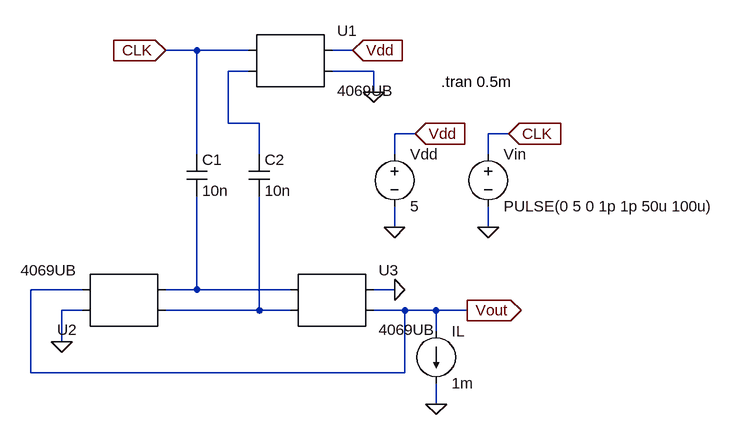
[diagram p0: schematic Q2.asc]
Q2.asc, the LTspice schematic file:
Version 4
SHEET 1 1204 752
WIRE 336 192 288 192
WIRE 416 192 336 192
WIRE 576 192 544 192
WIRE 416 224 384 224
WIRE 608 224 544 224
WIRE 608 256 608 224
WIRE 384 304 384 224
WIRE 432 304 384 304
WIRE 672 320 640 320
WIRE 816 320 784 320
WIRE 336 352 336 192
WIRE 432 352 432 304
WIRE 640 352 640 320
WIRE 784 352 784 320
WIRE 640 464 640 432
WIRE 784 464 784 432
WIRE 160 560 80 560
WIRE 336 560 336 416
WIRE 336 560 288 560
WIRE 480 560 336 560
WIRE 640 560 608 560
WIRE 160 592 128 592
WIRE 432 592 432 416
WIRE 432 592 288 592
WIRE 480 592 432 592
WIRE 656 592 608 592
WIRE 704 592 656 592
WIRE 752 592 704 592
WIRE 704 624 704 592
WIRE 128 640 128 592
WIRE 80 688 80 560
WIRE 656 688 656 592
WIRE 656 688 80 688
WIRE 704 736 704 704
FLAG 608 256 0
FLAG 640 464 0
FLAG 784 464 0
FLAG 672 320 Vdd
IOPIN 672 320 In
FLAG 816 320 CLK
IOPIN 816 320 In
FLAG 576 192 Vdd
IOPIN 576 192 In
FLAG 704 736 0
FLAG 752 592 Vout
IOPIN 752 592 Out
FLAG 640 560 0
FLAG 128 640 0
FLAG 288 192 CLK
IOPIN 288 192 In
SYMBOL voltage 784 336 R0
SYMATTR InstName Vin
SYMATTR Value PULSE(0 5 0 1p 1p 50u 100u)
SYMBOL voltage 640 336 R0
SYMATTR InstName Vdd
SYMATTR Value 5
SYMBOL AutoGenerated/4069UB 480 208 R0
SYMATTR InstName U1
SYMBOL cap 320 352 R0
SYMATTR InstName C1
SYMATTR Value 10n
SYMBOL cap 416 352 R0
SYMATTR InstName C2
SYMATTR Value 10n
SYMBOL AutoGenerated/4069UB 224 576 R180
SYMATTR InstName U2
SYMBOL AutoGenerated/4069UB 544 576 R0
SYMATTR InstName U3
SYMBOL current 704 624 R0
SYMATTR InstName IL
SYMATTR Value 1m
TEXT 712 240 Left 2 !.tran 0.5m

The netlist it stands for:
* Q2.asc
Vin CLK 0 PULSE(0 5 0 1p 1p 50u 100u)
Vdd Vdd 0 5
* U1: 4069UB (symbol AutoGenerated/4069UB not available, pins judged from their places): pin1=CLK pin2=N001 pin3=Vdd pin4=0
C1 CLK N002 10n
C2 N001 N003 10n
* U2: 4069UB (symbol AutoGenerated/4069UB not available, pins judged from their places): pin1=N003 pin2=N002 pin3=0 pin4=Vout
* U3: 4069UB (symbol AutoGenerated/4069UB not available, pins judged from their places): pin1=N002 pin2=N003 pin3=0 pin4=Vout
IL Vout 0 1m
.tran 0.5m
.backanno
.end